# EAGLE design DCM module board (EAGLE 9.6.2)
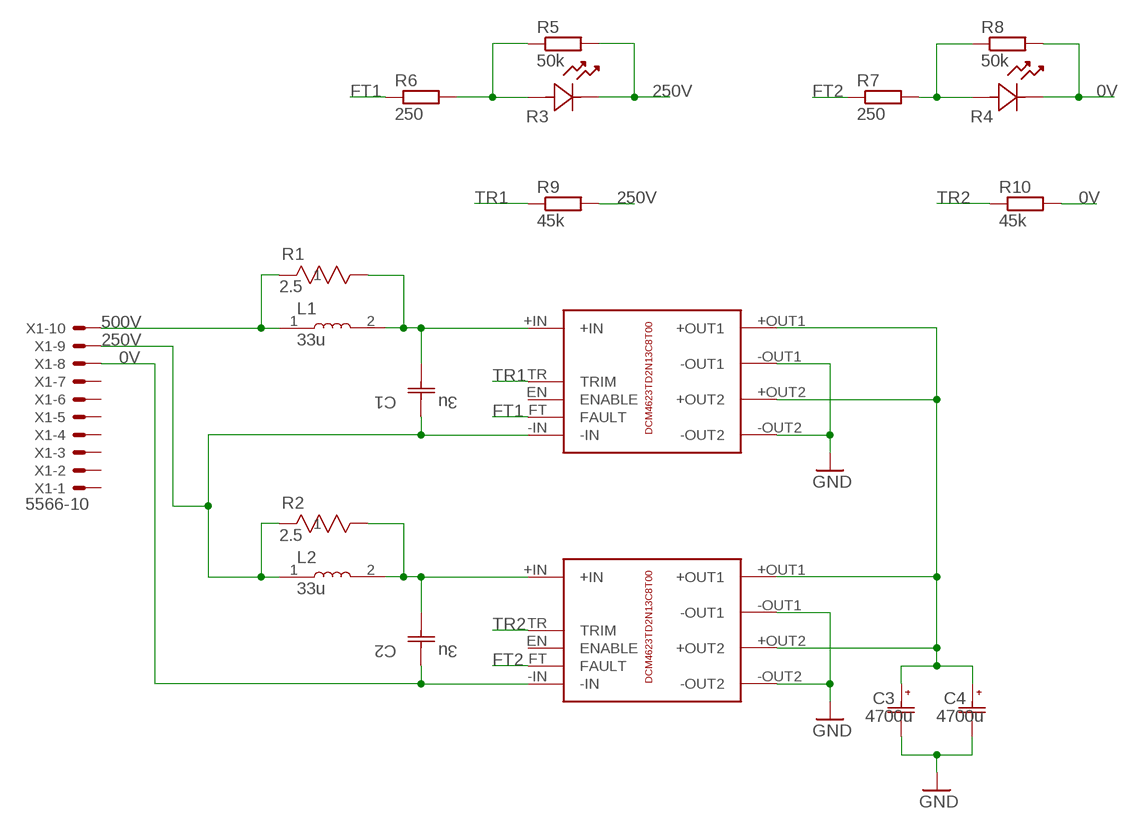
[diagram p0: schematic, sheet 1]

## Parts
C1  3u  B58035U5305M062  [CAP_B58035U5305M062_TDK]
C2  3u  B58035U5305M062  [CAP_B58035U5305M062_TDK]
C3  4700u  UBY1E472MHL1TN  [CAP_UBX_16X25_NCH]
C4  4700u  UBY1E472MHL1TN  [CAP_UBX_16X25_NCH]
L1  33u  SRP1265A-330M  [IND_SRP1265A-330M]
L2  33u  SRP1265A-330M  [IND_SRP1265A-330M]
R1  2.5  TEH100M2R50FE  [RES_TEH100_OHM]
R2  2.5  TEH100M2R50FE  [RES_TEH100_OHM]
R3  SLR-56VR3F  [LED_SLR-56_ROM]
R4  SLR-56VR3F  [LED_SLR-56_ROM]
R5  50k  R-EU_R0805  [R0805]
R6  250  R-EU_R0805  [R0805]
R7  250  R-EU_R0805  [R0805]
R8  50k  R-EU_R0805  [R0805]
R9  45k  R-EU_R0805  [R0805]
R10  45k  R-EU_R0805  [R0805]
U$1  DCM4623TD2N13C8T00  [DCM4623TD2N13C8T00]
U$2  DCM4623TD2N13C8T00  [DCM4623TD2N13C8T00]
X1  5566-10  [5566-10]

## Nets
0V: C2.1 R4.1 R8.2 R10.2 U$2.-IN X1.8
250V: C1.1 L2.1 R2.1 R3.1 R5.2 R9.2 U$1.-IN X1.9
500V: L1.1 R1.1 X1.10
FT1: R6.1 U$1.FT(FAULT)
FT2: R7.1 U$2.FT(FAULT)
GND: C3.2 C4.2 U$1.-OUT1 U$1.-OUT2 U$2.-OUT1 U$2.-OUT2
N$1: C1.2 L1.2 R1.3 U$1.+IN
N$3: C3.1 C4.1 U$1.+OUT1 U$1.+OUT2 U$2.+OUT1 U$2.+OUT2
N$4: C2.2 L2.2 R2.3 U$2.+IN
N$6: R3.2 R5.1 R6.2
N$9: R4.2 R7.2 R8.1
TR1: R9.1 U$1.TR(TRIM)
TR2: R10.1 U$2.TR(TRIM)
Unconnected: U$1.EN(ENABLE) U$2.EN(ENABLE) X1.1 X1.2 X1.3 X1.4 X1.5 X1.6 X1.7

## Library data of the parts
C1 C2 = capacitor-emi:B58035U5305M062; BUILT_BY: EMA_Justin; COPYRIGHT: Copyright (C) 2018 Accelerated Designs. All rights reserved; MANUFACTURER_PART_NUMBER: B58035U5305M062; SOURCELIBRARY: TDK_2019-11-13; VENDOR: TDK
C3 C4 = Nichicon:UBY1E472MHL1TN; BUILT_BY: EMA_Cory; COPYRIGHT: Copyright (C) 2018 Accelerated Designs. All rights reserved; MANUFACTURER_PART_NUMBER: UBY1E472MHL1TN; SOURCELIBRARY: Nichicon_2019-09-13; VENDOR: Nichicon
L1 L2 = SRP1265A-330M:SRP1265A-330M: Inductor Power Shielded Wirewound 33uH 20% 100KHz Carbonyl Powder 8A 58mOhm DCR Automotive T/R; DESCRIPTION: 33µH Shielded Wirewound Inductor 8A 58mOhm Max Nonstandard; DIGI-KEY_PART_NUMBER: SRP1265A-330MCT-ND; MF: Bourns; MP: SRP1265A-330M; PACKAGE: 1008 Bourns; PURCHASE-URL: https://pricing.snapeda.com/search/part/SRP1265A-330M/?ref=eda
R1 R2 = TEH100M2R50FE:TEH100M2R50FE; BUILT_BY: EMA_UL_Team; MANUFACTURER_PART_NUMBER: TEH100M2R50FE; SOURCELIBRARY: Ohmite_2015_05_22; VENDOR: Ohmite
R3 R4 = SLR-56VR3F:SLR-56VR3F; BUILT_BY: EMA_Matt; COPYRIGHT: Copyright (C) 2018 Accelerated Designs. All rights reserved; MANUFACTURER_PART_NUMBER: SLR-56VR3F; SOURCELIBRARY: Rohm_2019-09-23; VENDOR: ROHM Semiconductor
R5-R10 = rcl:R-EU_: RESISTOR, European symbol; SPICEPREFIX: R
U$1 U$2 = dc-dc-converter:DCM4623TD2N13C8T00: Vicor DCM4623TD2N13C8T00 DC-DC Converter Module
X1 = con-molex:5566-10: Mini FIT connector 10 pol Source: http://www.molex.com; MF: MOLEX; OC_FARNELL: unknown; OC_NEWARK: unknown

## Board
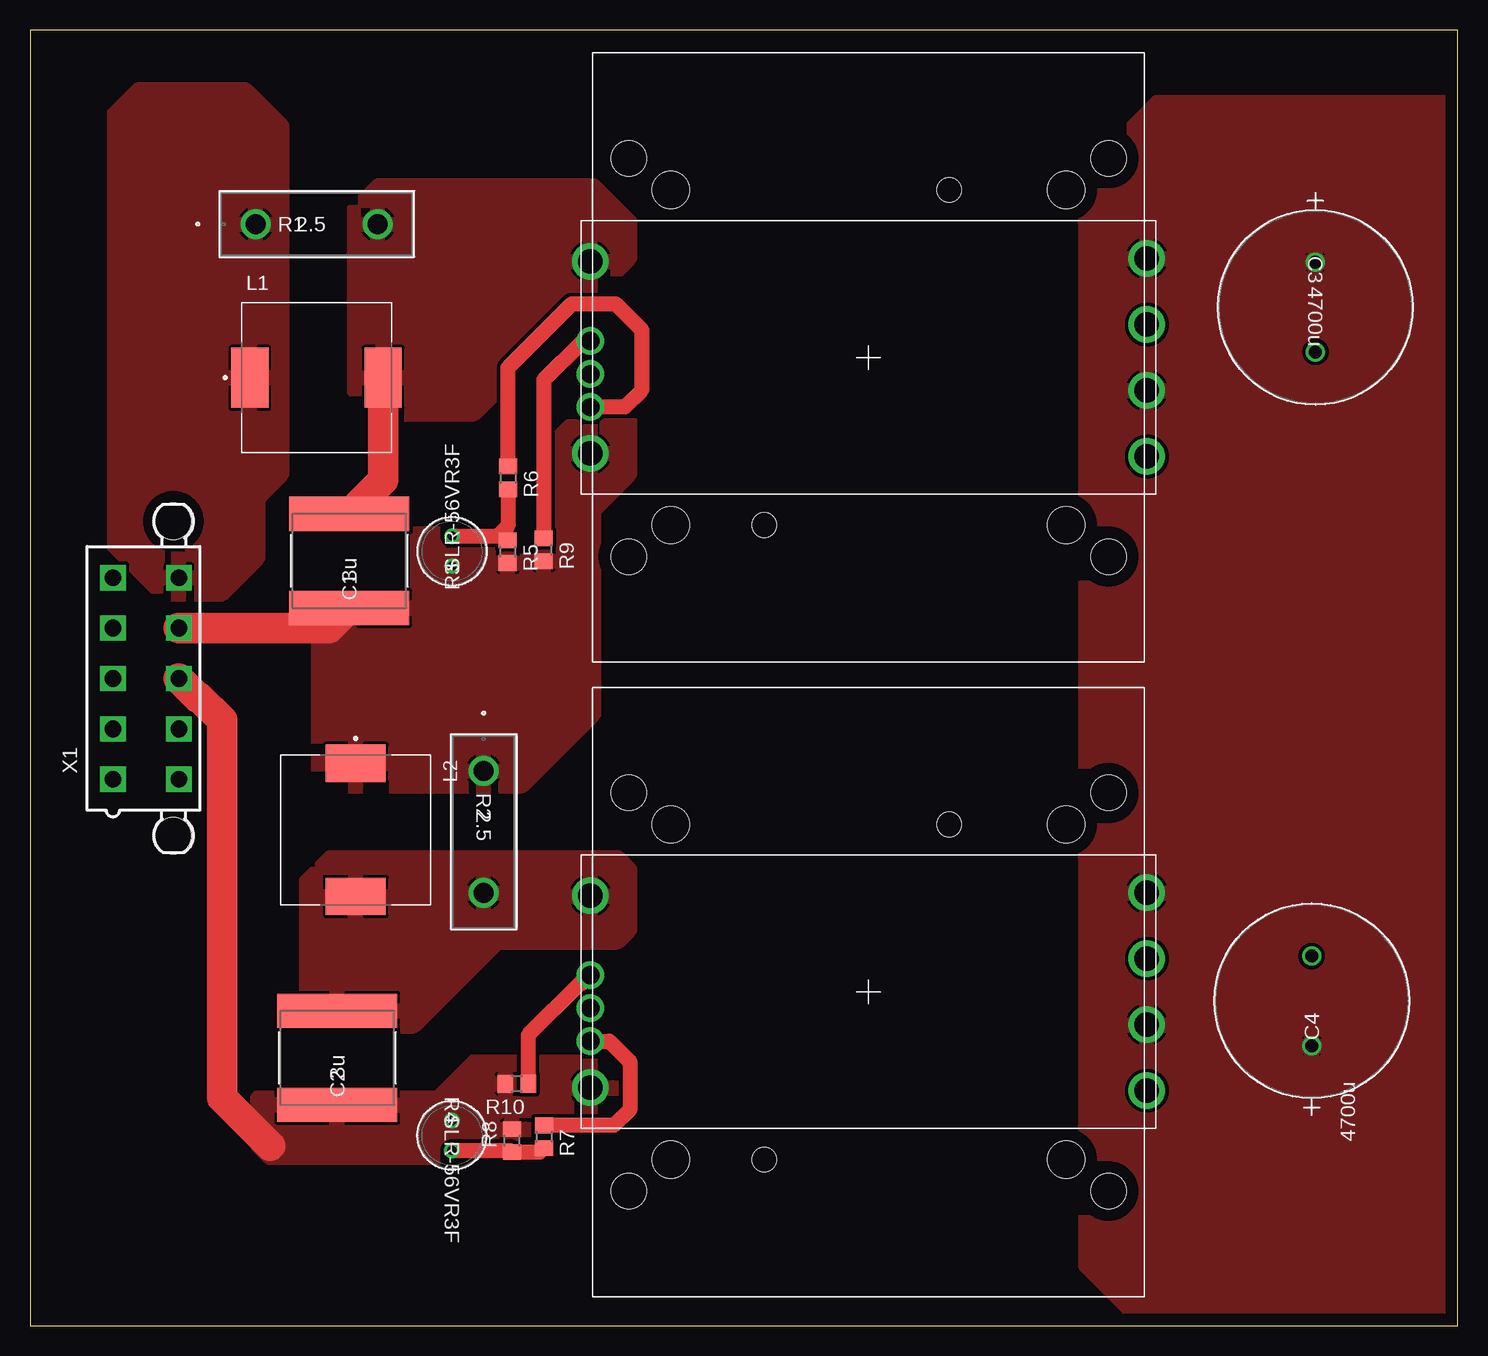
[diagram p1: board, top side]
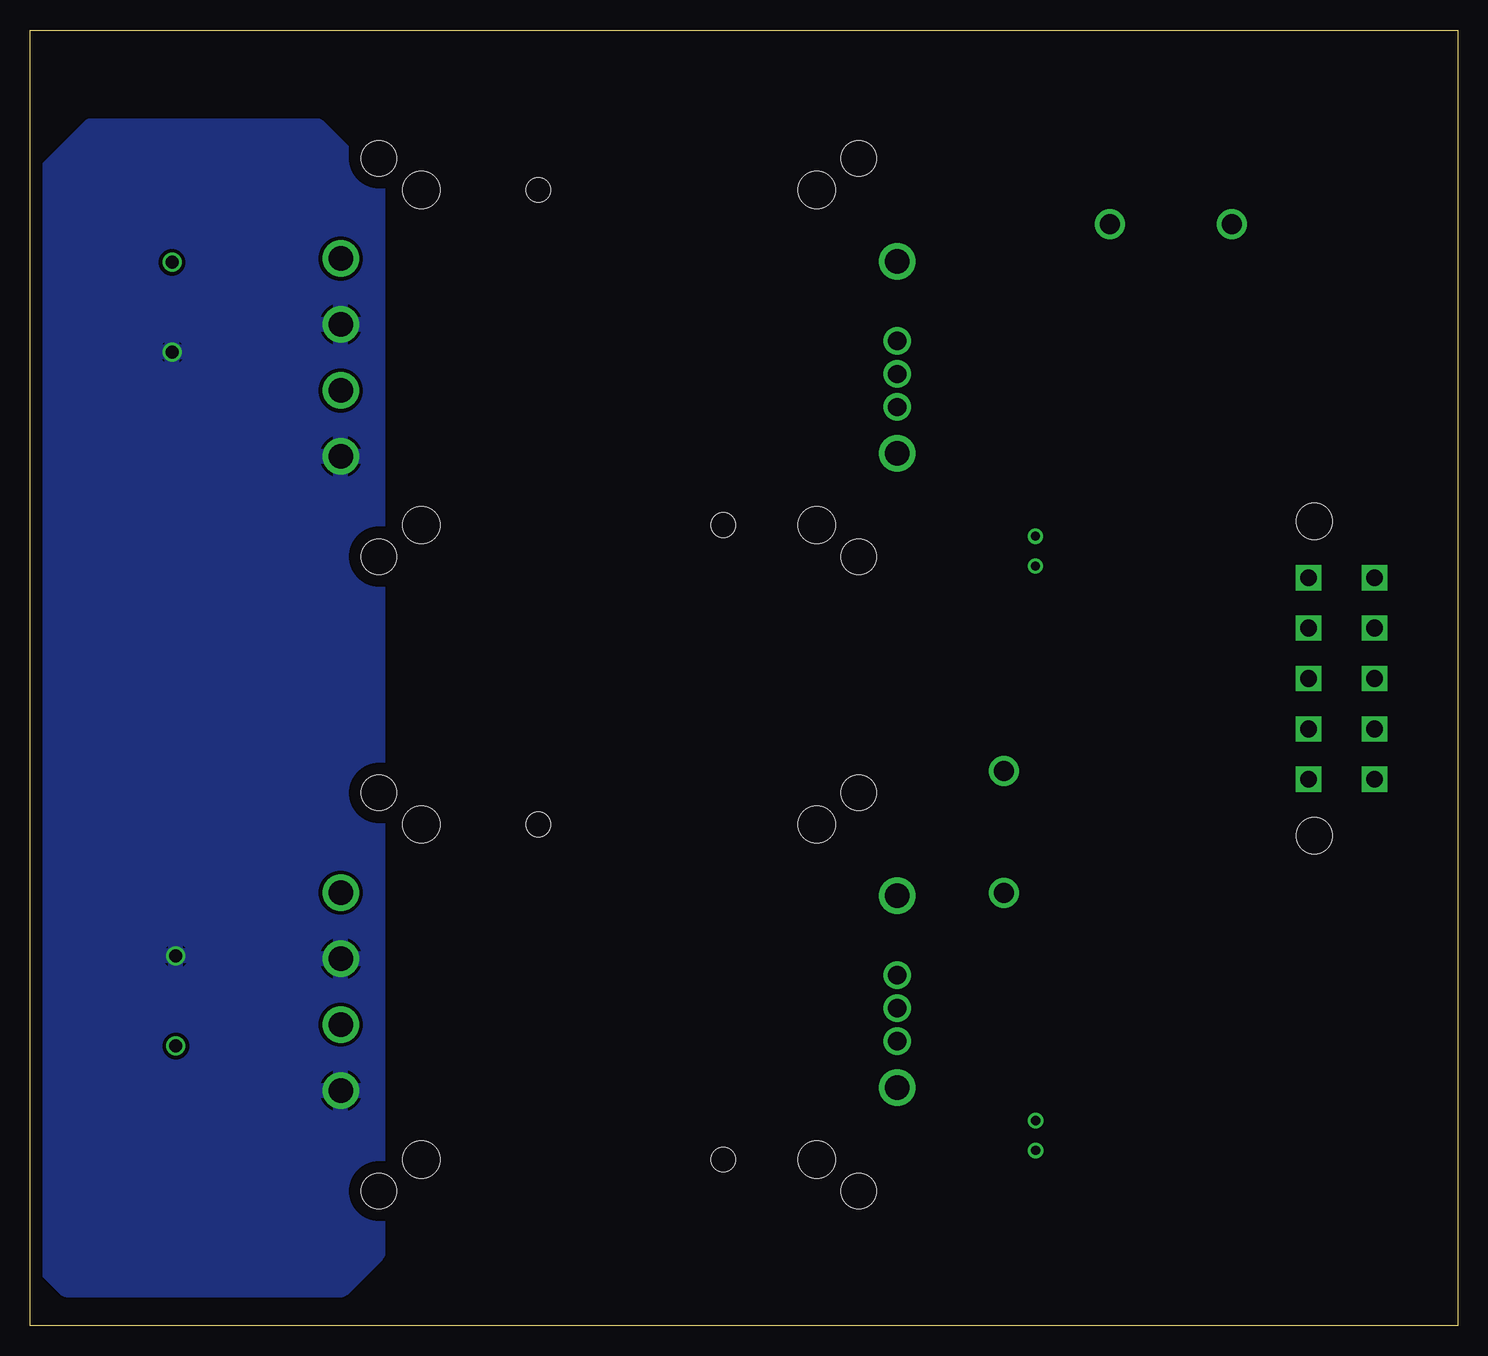
[diagram p2: board, bottom side, seen from below]

Size 119 x 108 mm. Coordinates in mm from the lower left corner, seen from the top.
Outline: 0,0 119,0 119,108 0,108 0,0
Copper layers (1*16): Top 0.035mm / dielectric 1.5mm / Bottom 0.035mm
Design rules "default *": minimum track width 6mil, minimum drill 0.35mm, track to track 12mil, track to pad 12mil, pad to pad 12mil, via to via 12mil, smd to smd 6mil, copper to edge 40mil, drill to drill 6mil, minimum pad ring 10mil, minimum via ring 8mil, stop-mask expansion 4mil, vias tented up to drill 0mil, thermal gap 10mil

### Footprints (pad centres in the part's own frame; a part is rotated, then mirrored left to right if it is on the bottom)
CAP_B58035U5305M062_TDK = smd 2.845 x 10.008: 1 -3.924,0; 2 3.924,0
CAP_UBX_16X25_NCH = drill 1.067 pad 1.575: 1 0,0; 2 7.493,0
IND_SRP1265A-330M = smd 3.1 x 5: 1 -5.55,0; 2 5.55,0
RES_TEH100_OHM = drill 1.676 pad 2.184: 1 0,0; 3 10.16,0
LED_SLR-56_ROM = drill 0.762 pad 1.27: 1 -2.489,0; 2 0,0
R0805 = smd 1.3 x 1.5: 1 -0.95,0; 2 0.95,0
DCM4623TD2N13C8T00 = drill 2.03: +IN -23.19,8; +OUT1 23.19,8.25; +OUT2 23.19,-2.75; -IN -23.19,-8; -OUT1 23.19,2.75; -OUT2 23.19,-8.25 | drill 1.52: EN -23.19,-1.38; FT -23.19,-4.13; TR -23.19,1.38
1102-40408-ND = hole 2.95: 20,16.6; -20,16.6; -20,-16.6; 20,-16.6 | hole 3.1: -16.47,13.97; 16.47,13.97; 16.47,-13.97; -16.47,-13.97 | hole 2.03: -8.71,-13.97; 6.71,13.97
5566-10 = drill 1.4 square: 1 8.4,-2.75; 2 4.2,-2.75; 3 0,-2.75; 4 -4.2,-2.75; 5 -8.4,-2.75; 6 8.4,2.75; 7 4.2,2.75; 8 0,2.75; 9 -4.2,2.75; 10 -8.4,2.75 | hole 3: 13.1,2.29; -13.1,2.29

### Placement (x,y rotation side)
C1  26.61,63.74 90 top
C2  25.61,22.31 90 top
C3  107.15,88.64 270 top
C4  106.85,23.31 90 top
L1  23.88,79.02 0 top
L2  27.15,41.32 270 top
R1  18.82,91.82 0 top
R2  37.82,46.23 270 top
R3  35.18,65.8 90 top
R4  35.17,14.59 270 top
R5  39.82,64.51 270 top
R6  39.85,70.66 270 top
R7  42.85,15.74 270 top
R8  40.18,15.41 90 top
R9  42.82,64.67 270 top
R10  40.58,20.15 180 top
U$1  69.9,80.7 0 top
U$2  69.9,27.83 0 top
U$3  1102-40408-ND  [1102-40408-ND]  69.9,27.8 0 top
U$4  1102-40408-ND  [1102-40408-ND]  69.9,80.7 0 top
X1  9.66,53.94 270 top

### Tracks (layer width: path | path; a pad name or v marks a point on that pad's centre or on a via)
0V
  Top 2.54: X1.8 13.98,52.37 14.11,52.37 16,50.48 16,19 20,15
  pour Top: 37,22 49,22 49,14 20,14 19,15 19,19 34,19
250V
  Top 2.54: C1.1 24.93,58.14 X1.9
  pour Top: 25,45 41,45 43,47 47,51 47,68 50,71 50,76 46,76 36,66 34,66 28,66 24,62 24,48 24,46
500V
  pour Top: 11,61 16,61 19,64 19,69 21,71 21,100 18,103 9,103 7,101 7,65
FT1
  Top 1.27: U$1.FT 49.57,76.57 51,78 51,83 48.84,85.16 45.16,85.16 39.85,79.85 R6.1
FT2
  Top 1.27: U$2.FT 48.3,23.7 50,22 50,18 48.69,16.69 R7.1
GND
  pour Bottom: 90,6 90,95 95,100 114,100 118,96 118,5 116,3 93,3
N$1
  Top 2.54: C1.2 29.43,70.48 L1.2
  pour Top: 29,76 37,76 47,86 50,89 50,92 47,95 29,95 27,93 27,78
N$3
  pour Top: 88,95 88,96 94,102 118,102 119,101 119,2 118,1 92,1 88,5
N$4
  pour Top: 24,25 32,25 39,32 49,32 50,33 50,38 49,39 25,39 23,37 23,26
N$6
  Top 1.27: R3.2 39,65.8 | 39,65.8 39.48,65.8 R5.1 | R6.2 39.85,66.65 39,65.8
N$9
  Top 1.27: R4.2 40.05,14.59 R8.1 42.52,14.46 R7.2
TR1
  Top 1.27: R9.1 42.82,78.82 46,82 46.63,82 U$1.TR
TR2
  Top 1.27: U$2.TR 46.03,28.53 45.85,28.53 41.53,24.21 R10.1